# EAGLE design stoveguard (EAGLE 9.6.2)
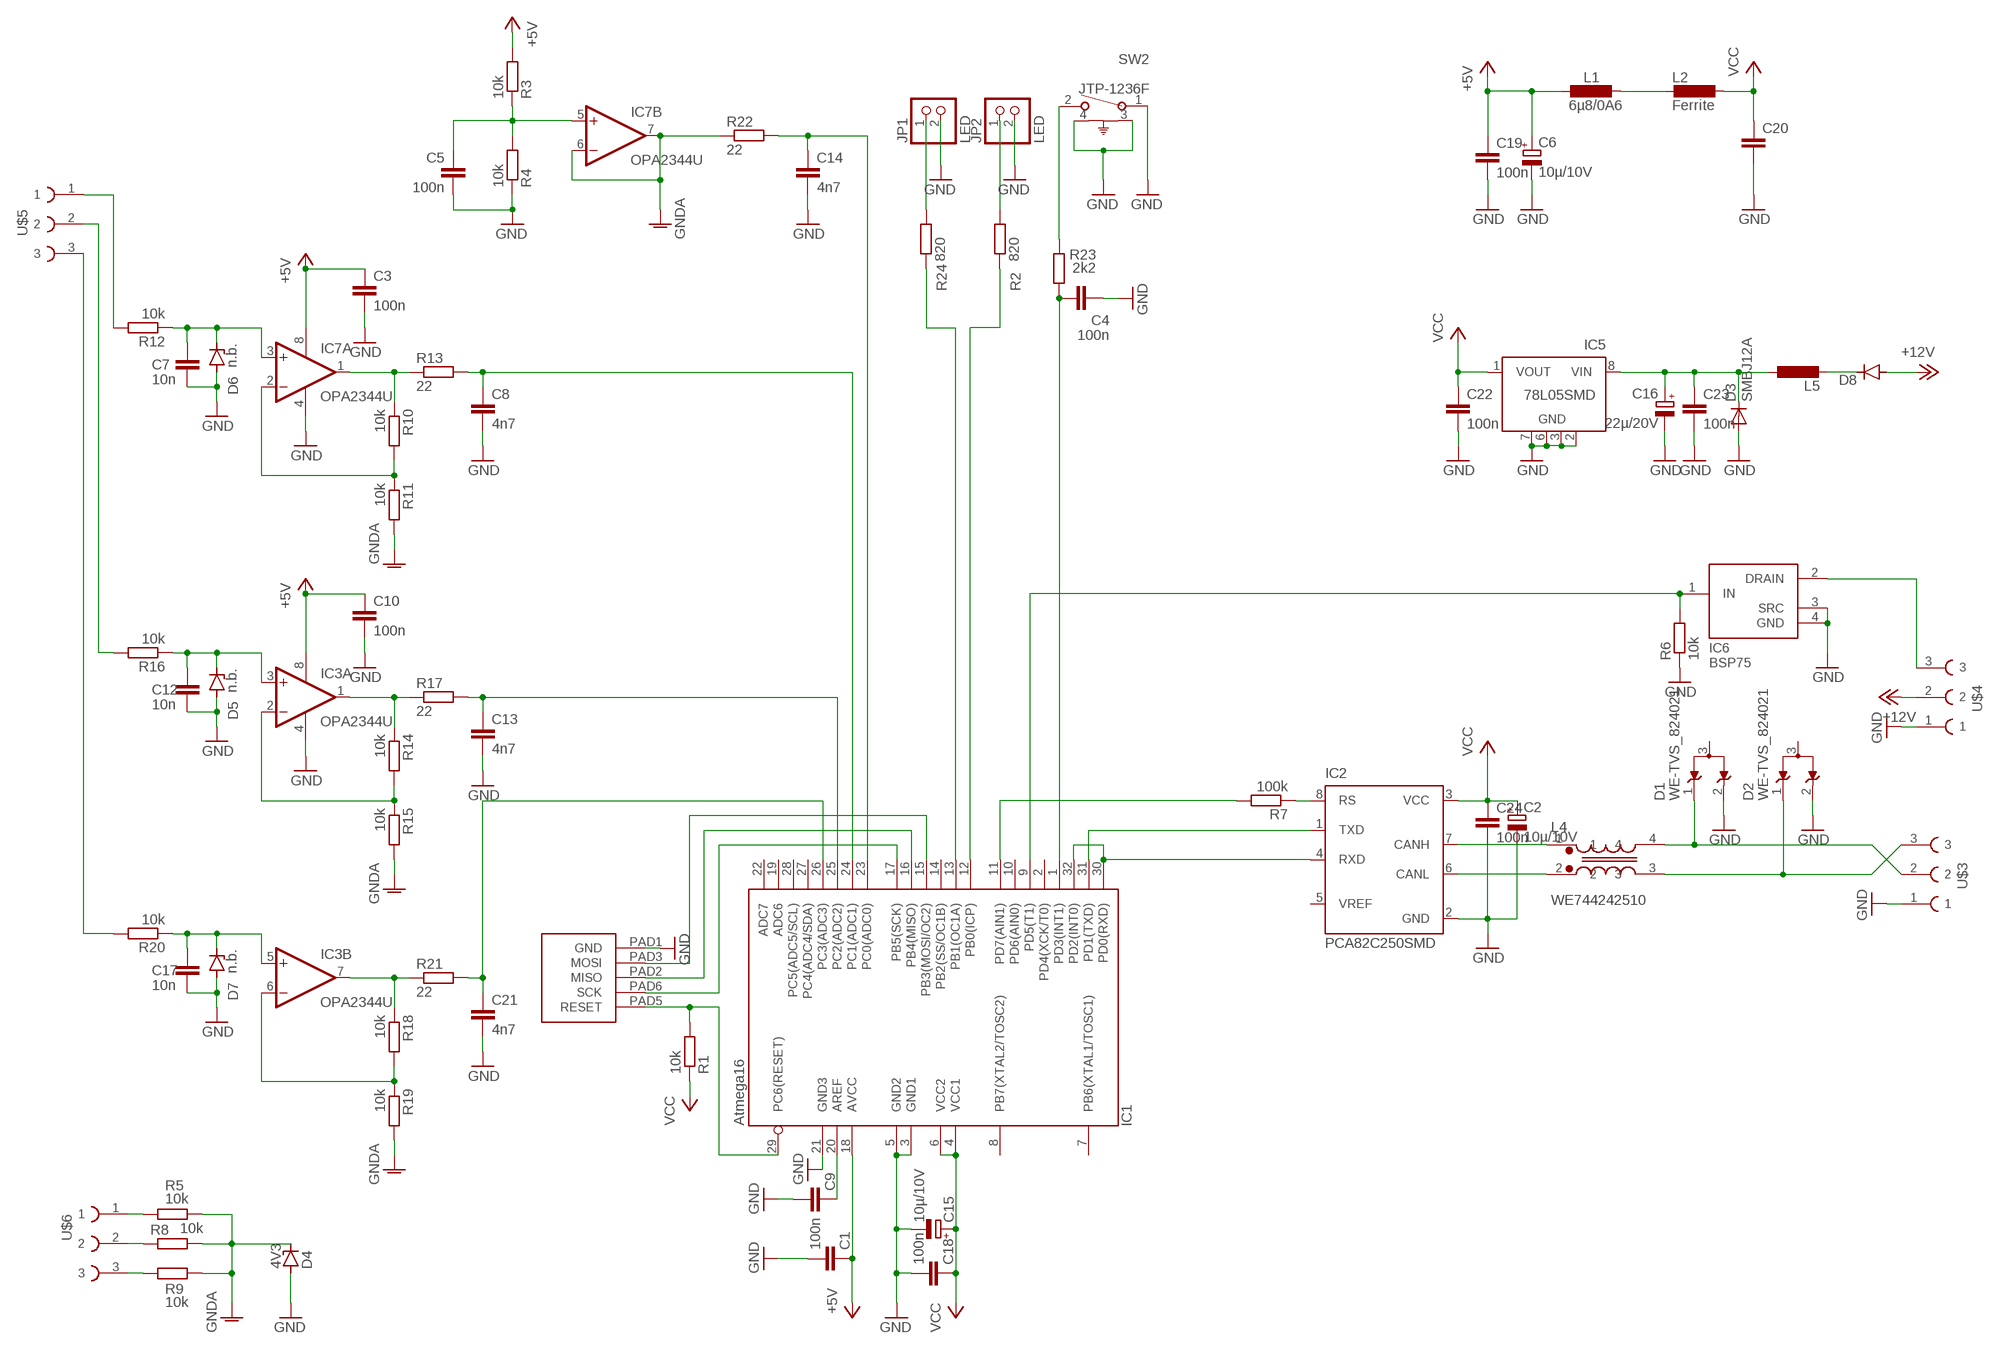
[diagram p0: schematic, sheet 1]

## Parts
C1  100n  CC0603  [C0603]
C2  10µ/10V  CPOL-EUA/3216-18W  [A/3216-18W]
C3  100n  CC0603  [C0603]
C4  100n  CC0603  [C0603]
C5  100n  CC0603  [C0603]
C6  10µ/10V  CPOL-EUA/3216-18W  [A/3216-18W]
C7  10n  CC0603  [C0603]
C8  4n7  CC0603  [C0603]
C9  CC1206  [C1206]
C10  100n  CC0603  [C0603]
C12  10n  CC0603  [C0603]
C13  4n7  CC0603  [C0603]
C14  4n7  CC0603  [C0603]
C15  10µ/10V  CPOL-EUA/3216-18W  [A/3216-18W]
C16  22µ/20V  CPOL-EUSMCC  [SMC_C]
C17  10n  CC0603  [C0603]
C18  100n  CC0603  [C0603]
C19  100n  CC0603  [C0603]
C20  CC0603  [C0603]
C21  4n7  CC0603  [C0603]
C22  100n  CC0603  [C0603]
C23  100n  CC0603  [C0603]
C24  100n  CC0603  [C0603]
D1  WE-TVS_824021  [WE-TVS_SOT23-3L]
D2  WE-TVS_824021  [WE-TVS_SOT23-3L]
D3  SMBJ12A  DIODE-SMB  [SMB]
D4  4V3  ZENER-DIODESOD80C  [SOD80C]
D5  n.b.  ZENER-DIODESOD80C  [SOD80C]
D6  n.b.  ZENER-DIODESOD80C  [SOD80C]
D7  n.b.  ZENER-DIODESOD80C  [SOD80C]
D8  DIODE-MINIMELF  [MINIMELF]
IC1  Atmega16  ATMEGA8  [TQFP32-08]
IC2  PCA82C250SMD  [SO8]
IC3  OPA2344U  [SO08]
IC5  78L05SMD  [SO08]
IC6  BSP75  [SOT223]
IC7  OPA2344U  [SO08]
JP1  LED  PINHD-1X2  [1X02]
JP2  LED  PINHD-1X2  [1X02]
L1  6µ8/0A6  L-EUL1812  [L1812]
L2  Ferrite  L-EUL1806  [L1806]
L4  WE744242510  WE-SLM  [WE-SLM]
L5  L-EUL1806  [L1806]
R1  10k  RR0603  [R0603]
R2  820  RR0603  [R0603]
R3  10k  RR0603  [R0603]
R4  10k  RR0603  [R0603]
R5  10k  RR0603  [R0603]
R6  10k  RR0603  [R0603]
R7  100k  RR0603  [R0603]
R8  10k  RR0603  [R0603]
R9  10k  RR0603  [R0603]
R10  10k  RR0603  [R0603]
R11  10k  RR0603  [R0603]
R12  10k  RR0603  [R0603]
R13  22  RR0603  [R0603]
R14  10k  RR0603  [R0603]
R15  10k  RR0603  [R0603]
R16  10k  RR0603  [R0603]
R17  22  RR0603  [R0603]
R18  10k  RR0603  [R0603]
R19  10k  RR0603  [R0603]
R20  10k  RR0603  [R0603]
R21  22  RR0603  [R0603]
R22  22  RR0603  [R0603]
R23  2k2  RR0603  [R0603]
R24  820  RR0603  [R0603]
SW2  JTP-1236F  1-1825027-4  [SW2_1825027-E]
U$2  ATMEL_ISP  [ATMEL_ISP]
U$3  MKDSO_2.5/3_L  [PHOENIX_MKDSO_2.5/3_L]
U$4  MKDSO_2.5/3_L  [PHOENIX_MKDSO_2.5/3_L]
U$5  MKDSO_2.5/3_R  [PHOENIX_MKDSO_2.5/3_R]
U$6  MKDSO_2.5/3_R  [PHOENIX_MKDSO_2.5/3_R]

## Nets
+5V: C1.1 C3.1 C6.+ C10.1 C19.1 IC1.18(AVCC) IC3.8(A:V+) IC7.8(A:V+) L1.2 R3.2
+12V: D8.A U$4.2
B+: D1.1 L4.4 U$3.2
B-: D2.1 L4.3 U$3.3
GND: C1.2 C2.- C3.2 C4.1 C5.2 C6.- C7.2 C8.2 C9.2 C10.2 C12.2 C13.2 C14.2 C15.- C16.- C17.2 C18.2 C19.2 C20.2 C21.2 C22.2 C23.2 C24.2 D1.2 D2.2 D3.A D4.A D5.A D6.A D7.A IC1.3(GND1) IC1.5(GND2) IC1.21(GND3) IC2.2(GND) IC3.4(A:V-) IC5.2(GND) IC5.3(GND) IC5.6(GND) IC5.7(GND) IC6.3(SRC) IC6.4(GND) IC7.4(A:V-) JP1.2 JP2.2 R4.1 R6.1 SW2.1 SW2.3 SW2.4 U$2.PAD1(GND) U$3.1 U$4.1
GNDA: D4.C IC7.6(B:-IN) IC7.7(B:OUT) R5.1 R8.1 R9.1 R11.2 R15.2 R19.2 R22.1
N$1: L1.1 L2.2
N$2: IC6.2(DRAIN) U$4.3
N$3: C9.1 IC1.20(AREF)
N$4: IC1.15(PB3(MOSI/OC2)) U$2.PAD3(MOSI)
N$5: IC1.16(PB4(MISO)) U$2.PAD2(MISO)
N$6: IC1.17(PB5(SCK)) U$2.PAD6(SCK)
N$7: IC1.9(PD5(T1)) IC6.1(IN) R6.2
N$8: R5.2 U$6.1
N$9: C5.1 IC7.5(B:+IN) R3.1 R4.2
N$10: IC2.7(CANH) L4.1
N$11: R8.2 U$6.2
N$12: R9.2 U$6.3
N$13: JP1.1 R24.2
N$14: IC1.12(PB0(ICP)) R2.1
N$15: IC1.11(PD7(AIN1)) R7.2
N$16: IC1.31(PD1(TXD)) IC2.1(TXD)
N$17: IC2.6(CANL) L4.2
N$18: IC1.30(PD0(RXD)) IC1.32(PD2(INT0)) IC2.4(RXD)
N$19: R12.2 U$5.1
N$20: IC1.29(PC6(RESET)) R1.2 U$2.PAD5(RESET)
N$21: C7.1 D6.C IC7.3(A:+IN) R12.1
N$22: IC7.2(A:-IN) R10.2 R11.1
N$23: IC7.1(A:OUT) R10.1 R13.1
N$24: C4.2 IC1.1(PD3(INT1)) R23.2
N$25: R23.1 SW2.2
N$26: C8.1 IC1.24(PC1(ADC1)) R13.2
N$27: IC2.8(RS) R7.1
N$28: C16.+ C23.1 D3.C IC5.8(VIN) L5.1
N$29: C12.1 D5.C IC3.3(A:+IN) R16.1
N$30: IC3.2(A:-IN) R14.2 R15.1
N$31: IC3.1(A:OUT) R14.1 R17.1
N$32: C13.1 IC1.25(PC2(ADC2)) R17.2
N$33: R16.2 U$5.2
N$34: C17.1 D7.C IC3.5(B:+IN) R20.1
N$35: IC3.6(B:-IN) R18.2 R19.1
N$36: IC3.7(B:OUT) R18.1 R21.1
N$37: C21.1 IC1.26(PC3(ADC3)) R21.2
N$38: R20.2 U$5.3
N$39: C14.1 IC1.23(PC0(ADC0)) R22.2
N$40: D8.C L5.2
N$41: IC1.13(PB1(OC1A)) R24.1
N$42: JP2.1 R2.2
VCC: C2.+ C15.+ C18.1 C20.1 C22.1 C24.1 IC1.4(VCC1) IC1.6(VCC2) IC2.3(VCC) IC5.1(VOUT) L2.1 R1.1
Unconnected: D1.3(GND) D2.3(GND) IC1.2(PD4(XCK/T0)) IC1.7(PB6(XTAL1/TOSC1)) IC1.8(PB7(XTAL2/TOSC2)) IC1.10(PD6(AIN0)) IC1.14(PB2(SS/OC1B)) IC1.19(ADC6) IC1.22(ADC7) IC1.27(PC4(ADC4/SDA)) IC1.28(PC5(ADC5/SCL)) IC2.5(VREF) IC5.4(NC) IC5.5(NC)

## Library data of the parts
C1 C3-C5 C7-C10 C12-C14 C17-C24 = eagle-ltspice:C: CAPACITOR, European symbol; SPICEMODEL: NONE; SPICEPREFIX: C
C2 C6 C15 C16 = rcl:CPOL-EU: POLARIZED CAPACITOR, European symbol
D1 D2 = EagleLibrary_Wuerth_Elektronik_eiSos_V6_20140807:WE-TVS_824021: TVS Diode Array WE-TVS, Standard Series - Low capazity - No leakage current - Low clamping voltage - high ESD voltage protection - Uni- and bidirectional protection -- DC Distribution -- Headsets and Accessoires -- PDAs -- Digital Cameras -- MP3-Players -- Touch Panels <http://katalog.we-online.de/media/images/eisos/VarTVS_highspeed_pf2.jpg.jpg> Details see: http://katalog.we-online.de/en/pbs/WE-TVS_High_Speed? Updated by Dan Xu 2014-07-11 2014 (C) Würth Elektronik
D3 D8 = diode:DIODE-: DIODE
D4-D7 = diode:ZENER-DIODE: Z-Diode
IC1 = mylib:ATMEGA8: 8-bit AVR with 8K Bytes In-System Programmable Flash
IC2 = mylib:PCA82C250: CAN CONTROLLER INTERFACE
IC3 IC7 = linear:OPA2*: Dual Operational Amplifier Low Power, Single-Supply, Rail-To-Rail Operational Amplifier Source: http://focus.ti.com/lit/ds/symlink/opa2345.pdf http://focus.ti.com .. opa241.pdf http://focus.ti.com/lit/ds/symlink/opa2134.pdf
IC5 = linear:78L*SMD: Positive VOLTAGE REGULATOR
IC6 = mylib:BSP75
JP1 JP2 = pinhead:PINHD-1X2: PIN HEADER
L1 = rcl:L-EU: INDUCTOR, European symbol
L2 L5 = mylib:L-EU: INDUCTOR, European symbol
L4 = EagleLibrary_Wuerth_Elektronik_eiSos_V6_20140807:WE-SLM: SMD Common Mode Line Filter WE-SLM - Small size - Low Profile - High Impedance - High current capability up to 300 mA -- USB -- CAN -- Firewire -- Data Lines -- Power supply systems -- Signal Lines <http://katalog.we-online.de/media/images/eisos/IndSLM_pf2.jpg> Details see: http://katalog.we-online.de/en/pbs/WE-SLM?? Updated by Dan Xu 2014-07-11 2014 (C) Würth Elektronik
R1-R24 = eagle-ltspice:R: RESISTOR, European symbol; SPICEMODEL: NONE; SPICEPREFIX: R
SW2 = Switches:1-1825027-4; BUILT_BY: EMA_UL_Team; CATEGORY: Tactile Switches; CONFIGURATION__POLE-THROW_: Single Pole - Single Throw; CONTACT_CURRENT_RATING: 50; COPYRIGHT: Copyright (C) 2016 Accelerated Designs. All rights reserved; DESCRIPTION: FSMRA5JH04=R/A,TACT PB SW,160G; MANUFACTURER_PART_NUMBER: 1-1825027-4; MAX_SWITCHING_CURRENT: -; MAX_SWITCHING_VOLTAGE_AC_: -; PART_STATUS: active; PRODUCT_TYPE: Switch; SERIES: Unknown; SWITCH_TYPE: Tactile Switches; TE_INTERNAL_NUMBER: 1-1825027-4; TE_PART_NUMBER: 1-1825027-4; VENDOR: TE Connectivity; VOLTAGE_RATING: -
U$2 = mylib:ATMEL_ISP
U$3 U$4 = mylib:MKDSO_2.5/3_L
U$5 U$6 = mylib:MKDSO_2.5/3_R

## Board
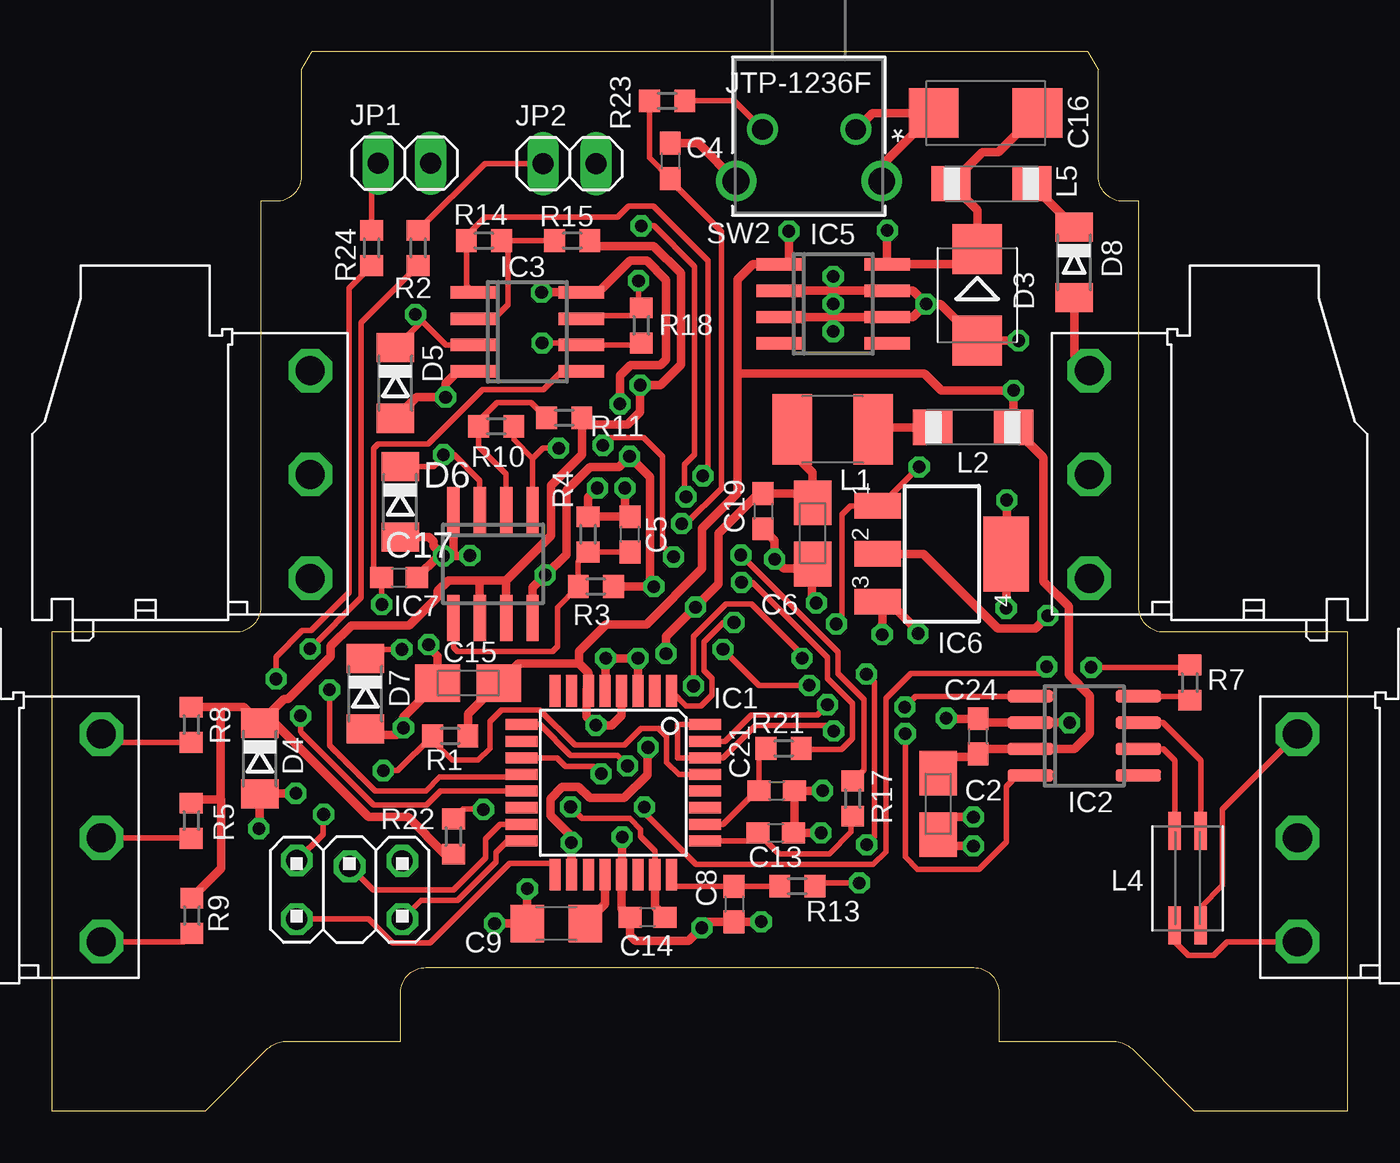
[diagram p1: board, top side]
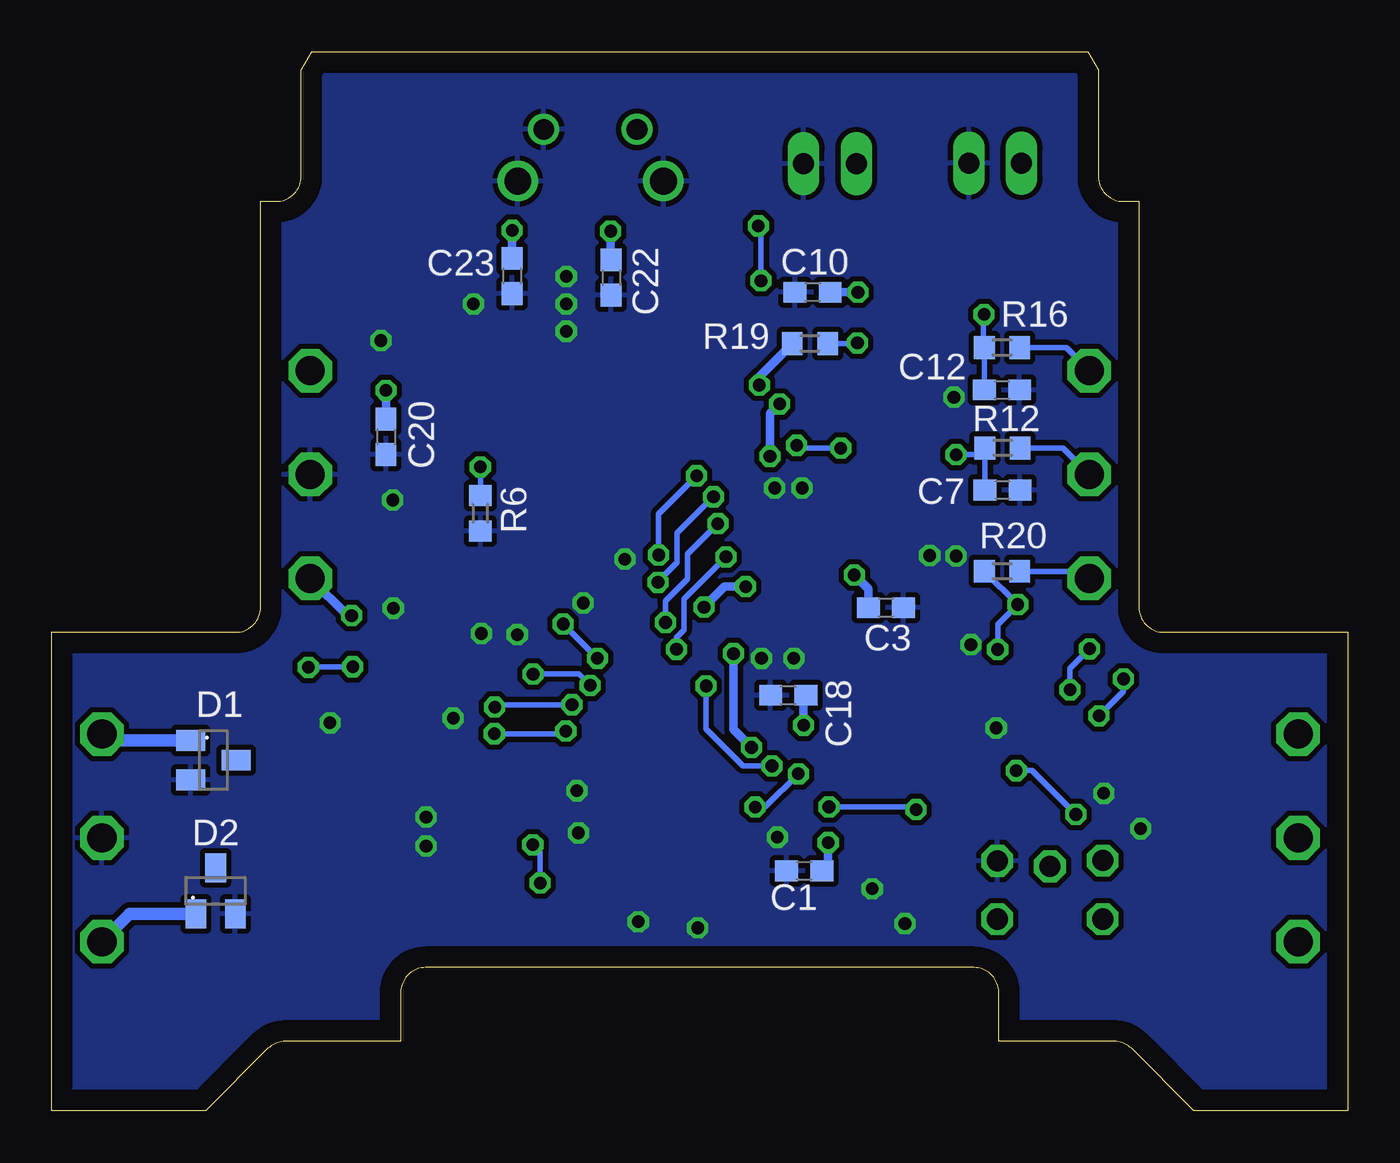
[diagram p2: board, bottom side, seen from below]

Size 62.4 x 51 mm. Coordinates in mm from the lower left corner, seen from the top.
Copper layers (1*16): Top 0.035mm / dielectric 1.5mm / Bottom 0.035mm
Design rules "Bilex DRU *": minimum track width 10mil, minimum drill 24mil, track to track 10mil, track to pad 10mil, pad to pad 10mil, via to via 10mil, smd to smd 10mil, copper to edge 40mil, drill to drill 8mil, minimum pad ring 10mil, minimum via ring 8mil, stop-mask expansion 4mil, vias tented up to drill 0mil, thermal gap 10mil

### Footprints (pad centres in the part's own frame; a part is rotated, then mirrored left to right if it is on the bottom)
C0603 = smd 1.1 x 1: 1 -0.85,0; 2 0.85,0
A/3216-18W = smd 2.15 x 1.8: + 1.475,0; - -1.475,0
C1206 = smd 1.6 x 1.8: 1 -1.4,0; 2 1.4,0
SMC_C = smd 2.4 x 2.4: + -2.5,0; - 2.5,0
WE-TVS_SOT23-3L = smd 1 x 1.4: 1 -0.95,-1.1; 2 0.95,-1.1; 3 0,1.1
SMB = smd 2.4 x 2.4: A 2.2,0; C -2.2,0
SOD80C = smd 1.4 x 1.8: A 1.7,0; C -1.7,0
MINIMELF = smd 1.4 x 1.8: A 1.7,0; C -1.7,0
TQFP32-08 = smd 1.524 x 0.533: 1 -4.42,2.8; 2 -4.42,2; 3 -4.42,1.2; 4 -4.42,0.4; 5 -4.42,-0.4; 6 -4.42,-1.2; 7 -4.42,-2; 8 -4.42,-2.8; 17 4.42,-2.8; 18 4.42,-2; 19 4.42,-1.2; 20 4.42,-0.4; 21 4.42,0.4; 22 4.42,1.2; 23 4.42,2; 24 4.42,2.8 | smd 0.533 x 1.524: 9 -2.8,-4.42; 10 -2,-4.42; 11 -1.2,-4.42; 12 -0.4,-4.42; 13 0.4,-4.42; 14 1.2,-4.42; 15 2,-4.42; 16 2.8,-4.42; 25 2.8,4.42; 26 2,4.42; 27 1.2,4.42; 28 0.4,4.42; 29 -0.4,4.42; 30 -1.2,4.42; 31 -2,4.42; 32 -2.8,4.42
SO8 = smd 0.6 x 2.2: 1 -1.905,-2.6; 2 -0.635,-2.6; 3 0.635,-2.6; 4 1.905,-2.6; 5 1.905,2.6; 6 0.635,2.6; 7 -0.635,2.6; 8 -1.905,2.6
SO08 = smd 0.6 x 2.2: 1 -1.905,-2.6; 2 -0.635,-2.6; 3 0.635,-2.6; 4 1.905,-2.6; 5 1.905,2.6; 6 0.635,2.6; 7 -0.635,2.6; 8 -1.905,2.6
SOT223 = smd 1.219 x 2.235: 1 -2.311,-3.099; 2 0,-3.099; 3 2.311,-3.099 | smd 3.6 x 2.2: 4 0,3.099
1X02 = drill 1.016 long: 1 -1.27,0; 2 1.27,0
L1812 = smd 1.9 x 3.4: 1 -1.95,0; 2 1.95,0
L1806 = smd 1.9 x 1.7: 1 -0.68,0; 2 3.22,0
WE-SLM = smd 1.85 x 0.6: 1 -2.28,0.63; 2 -2.28,-0.62; 3 2.27,-0.62; 4 2.27,0.63
R0603 = smd 1 x 1.1: 1 -0.85,0; 2 0.85,0
SW2_1825027-E = drill 0.991 pad 1.499: 1 0,0; 2 4.496,0 | drill 1.295 pad 1.803: 3 -1.245,2.489; 4 5.766,2.489
ATMEL_ISP = drill 1.016 octagon: PAD1 1.397,-2.54; PAD2 -1.41,-2.54; PAD3 1.13,0; PAD5 1.41,2.54; PAD6 -1.41,2.54
PHOENIX_MKDSO_2.5/3_L = drill 1.4 octagon: 1 -7.1,-0.62; 2 -7.1,4.38; 3 -7.1,-5.62
PHOENIX_MKDSO_2.5/3_R = drill 1.4 octagon: 1 7.1,-0.62; 2 7.1,4.38; 3 7.1,-5.62

### Placement (x,y rotation side)
C1  26.17,11.56 180 bottom
C2  42.68,14.78 90 top
C3  22.23,24.23 0 bottom
C4  29.78,45.75 270 top
C5  27.85,27.76 90 top
C6  36.64,27.81 90 top
C7  16.62,29.9 0 bottom
C8  32.85,9.96 270 top
C9  24.29,9.02 180 top
C10  25.76,39.42 180 bottom
C12  16.65,34.72 0 bottom
C13  34.86,13.39 0 top
C14  28.69,9.32 180 top
C15  20.05,20.6 0 top
C16  44.97,48.06 180 top
C17  16.72,25.68 0 top
C18  26.93,20.02 180 bottom
C19  34.25,28.88 270 top
C20  46.31,32.46 270 bottom
C21  34.91,15.42 0 top
C22  35.47,40.13 270 bottom
C23  40.24,40.21 270 bottom
C24  44.61,18.03 90 top
D1  54.62,16.89 270 bottom
D2  54.52,10.59 0 bottom
D3  44.56,39.29 270 top
D4  10.02,16.97 270 top
D5  16.54,35.05 270 top
D6  16.77,29.34 270 top
D7  15.1,20.09 270 top
D8  49.23,40.87 270 top
IC1  27.03,15.8 270 top
IC2  49.72,18.06 270 top
IC3  22.89,37.52 270 top
IC5  37.63,38.86 270 top
IC6  42.86,26.82 270 top
IC7  21.24,26.34 180 top
JP1  16.98,45.64 0 top
JP2  24.93,45.62 0 top
L1  37.6,32.82 180 top
L2  45.63,32.92 180 top
L4  54.7,11.2 270 top
L5  43.98,44.65 0 top
R1  19.19,18.06 180 top
R2  17.64,41.55 90 top
R3  26.2,25.25 0 top
R4  25.82,27.76 270 top
R5  6.71,13.97 270 top
R6  41.77,28.78 90 bottom
R7  54.8,20.62 90 top
R8  6.71,18.59 270 top
R9  6.74,9.4 270 top
R10  21.4,32.97 180 top
R11  24.67,33.38 0 top
R12  16.62,31.93 0 bottom
R13  35.9,10.82 180 top
R14  20.81,41.91 0 top
R15  25.05,41.91 0 top
R16  16.65,36.75 0 bottom
R17  38.57,15.04 270 top
R18  28.38,37.82 270 top
R19  25.89,36.96 180 bottom
R20  16.65,25.98 0 bottom
R21  35.24,17.45 180 top
R22  19.34,13.21 90 top
R23  29.63,48.64 180 top
R24  15.4,41.55 90 top
SW2  38.72,47.27 180 top
U$2  14.33,10.64 90 top
U$3  67.09,13.77 0 top
U$4  57.06,31.27 0 top
U$5  5.34,31.27 0 top
U$6  -4.72,13.77 0 top
U$7  [GEHÄUSE_PHOENIX_BC_17.8_REDUCED]  31.2,0 0 top

### Tracks (layer width: path | path; a pad name or v marks a point on that pad's centre or on a via)
+5V  (via drill 0.61)
  Top 0.406: L1.2 35.65,31.73 36.64,30.74 C6.+ 36.19,29.73 C19.1 34.04,29.73 32.11,27.8 32.11,25.36 v31,24.26 29.57,22.84 v29.57,22.02 | R3.2 v28.99,25.25 28.81,25.43 28.81,30.53 v27.82,31.52 27.31,31.01 25.92,31.01 24.77,29.86 24.77,26.8 23.78,25.81 v23.76,25.81 23.15,25.2 IC7.8 | v28.71,17.5 28.68,17.48 28.68,16.19 27.56,15.06 25.91,15.06 25.37,15.6 24.57,15.6 24.01,15.03 24.01,14.23 25.01,13.23 v25.01,12.92 25.03,12.9 IC1.18 | v23.58,39.42 IC3.8 26.32,39.42 27.85,40.95 28.65,40.95 29.59,40.01 29.59,36.19 29.31,35.92 27.87,35.92 27.36,35.4 v27.36,34.05
  Bottom 0.406: v31,24.26 30.01,25.25 v28.99,25.25 | v27.36,34.05 27.82,33.58 v27.82,31.52 | C1.1 25.01,11.86 v25.01,12.92 | C3.1 23.08,25.13 v23.76,25.81 | v28.71,17.5 29.57,18.36 v29.57,22.02 | C10.1 v23.58,39.42
+12V
  Top 0.406: U$4.2 49.23,36.37 D8.A
B+
  Top 0.254: L4.4 55.33,9.8 56.37,10.85 56.37,14.53 U$3.2
  Bottom 0.61: D1.1 59.68,17.84 U$3.2
B-
  Top 0.254: L4.3 54.08,8.14 54.72,7.49 55.96,7.49 56.61,8.15 U$3.3
  Bottom 0.61: D2.1 58.64,9.49 U$3.3
GND  (via drill 0.61)
  Top 0.254: 9.99,13.61 v9.97,13.59 | 11.62,15.24 11.69,15.24 v11.74,15.29
  Top 0.406: v18.14,22.45 18.14,22.33 18.57,21.9 C15.- 16.92,18.95 v16.92,18.44 16.59,18.11 15.38,18.11 D7.A | SW2.3 39.96,45.55 C16.- 39.51,48.06 SW2.1 | 37.63,39.5 IC5.7 41.46,39.5 v42.1,38.86 | 37.63,39.5 IC5.2 | IC5.3 IC5.6 41.46,38.23 v42.1,38.86 | v39.99,22.94 39.99,24.28 IC6.3 40.32,24.51 41.77,23.06 41.77,23.04 v41.72,22.99 | v36.81,24.46 36.61,24.66 36.61,26.31 36.64,26.29 C6.- 36.46,26.16 36.46,26.11 35.27,26.11 v34.81,26.57 34.81,27.47 C19.2 | v43.07,18.91 43.09,18.92 43.13,18.88 C24.2 44.8,18.69 IC2.2 v49,18.69 | v18.86,26.72 18.39,27.19 18.39,27.42 18.17,27.64 D6.A | v27.47,13.18 27.47,11.41 IC1.21 27.43,9.72 C14.2 27.83,8.45 28.1,8.18 30.67,8.18 v31.3,8.81 31.59,9.11 C8.2 v34.16,9.11 | v18.86,26.72 19.29,26.72 | 19.29,26.72 20.1,26.72 v20.13,26.75 | IC7.4 19.34,26.77 19.29,26.72 | C17.2 18.61,26.72 v18.86,26.72 | C4.1 31.14,46.59 SW2.4 | v11.74,15.29 10.04,15.29 D4.A 10.02,13.64 9.99,13.61 | IC1.3 v28.23,21.79 v26.67,21.79 26.67,20.25 IC1.5 | v45.98,29.41 45.98,26.85 IC6.4 v45.96,24.21 | v37.12,15.42 C21.2 35.76,13.44 C13.2 v37.04,13.39 | v42.1,38.86 42.79,38.86 D3.A v46.55,37.09 v46.55,37.1 | v37.63,40.18 37.63,39.5 | 37.63,39.5 v37.63,38.86 v37.63,37.54 | v26.27,30 25.82,29.54 R4.1 C5.2 27.59,28.87 v27.59,30 | v21.32,9.02 C9.2 v22.89,10.69 | IC3.4 19.54,35.61 18.96,35.03 v18.96,34.37 17.56,34.37 D5.A | v44.38,12.75 43.24,12.75 C2.- 43.52,14.15 v44.38,14.15
  pour Bottom: 0.01,0 62.39,0 62.39,5.23 62.39,51 36.94,51 0.01,51
GNDA  (via drill 0.61)
  Top 0.254: D4.C 9.86,18.82
  Top 0.406: D4.C | 9.86,18.82 9.24,19.44 8.14,19.44 | 8.14,19.44 R8.1 | R5.1 6.88,14.99 8.16,14.99 | R9.1 8.16,11.67 8.16,14.99 | 8.16,14.99 8.14,15.01 8.14,19.44 | R22.1 18.94,12.36 17.15,14.15 15.26,14.15 10.74,18.67 D4.C | D4.C 11.19,19.84 11.38,19.84 13.43,21.89 13.43,22.38 14.43,23.37 16.74,23.37 17.21,23.37 18.58,24.74 18.58,25.03 19.1,25.55 20.61,25.55 | R15.2 26.16,41.66 28.98,41.66 30.3,40.34 30.3,35.94 29.31,34.95 v28.33,34.95 28.33,33.66 27.73,33.05 25.84,33.05 R11.2 25.52,31.61 24.04,30.13 24.04,27.71 21.88,25.55 | 20.61,25.55 21.88,25.55 | 20.61,25.55 IC7.6 | IC7.7 21.88,25.55
  Bottom 0.406: R19.2 28.33,35.37 v28.33,34.95
N$1
  Top 0.406: L2.2 39.65,32.92 L1.1
N$2  (via drill 0.61)
  Top 0.406: IC6.2 41.98,26.82 45.56,23.24 47.35,23.24 v47.96,23.85
  Bottom 0.406: U$4.3 48.16,23.85 v47.96,23.85
N$3
  Top 0.406: IC1.20 26.63,9.96 C9.1
N$4
  Top 0.254: U$2.PAD3 15.46,10.64 19.34,10.64 20.89,12.19 20.89,13.11 21.58,13.8 IC1.15
N$5
  Top 0.254: U$2.PAD2 17.78,10.13 19.55,10.13 21.4,11.98 21.4,12.45 21.95,13 IC1.16
N$6
  Top 0.254: U$2.PAD6 15.26,9.23 16.4,8.09 18.22,8.09 22.04,11.91 24.21,11.91 24.23,11.89 IC1.17
N$7  (via drill 0.61)
  Top 0.254: v41.77,31.01 39.89,29.13 IC6.1 38.46,29.13 38.06,28.73 38.06,23.72 v37.78,23.44 | v30.89,20.46 30.89,22.85 32.46,24.41 33.7,24.41 36.13,21.98 v36.13,21.79 | IC1.9 23.5,18.6 24.98,17.12 27.25,17.12 27.72,16.65 v27.72,16.61
  Bottom 0.254: v36.13,21.79 v37.78,23.44 | v27.72,16.61 29.12,16.61 30.89,18.39 v30.89,20.46 | v41.77,31.01 R6.2
N$8
  Top 0.254: U$6.1 6.69,13.15 R5.2
N$9
  Top 0.254: C5.1 R4.2 25.35,26.44 R3.1 24.34,24.24 24.34,22.35 24.11,22.12 19.54,22.12 19.34,22.33 IC7.5
N$10
  Top 0.254: IC2.7 53.5,18.69 55.33,16.87 L4.1
N$11
  Top 0.254: U$6.2 2.79,17.74 R8.2
N$12
  Top 0.254: U$6.3 6.34,8.15 R9.2
N$13
  Top 0.254: R24.2 15.4,45.34 JP1.1
N$14  (via drill 0.61)
  Top 0.254: v13.37,20.28 13.37,17.6 15.55,15.42 18.01,15.42 18.67,16.08 22.5,16.08 IC1.12 | R2.1 14.89,37.96 14.89,24.71 v12.43,22.25
  Bottom 0.254: v12.43,22.25 13.37,21.31 v13.37,20.28
N$15  (via drill 0.61)
  Top 0.254: IC1.11 | IC1.11 24.32,17 24.73,16.59 26.09,16.59 v26.45,16.23 | v47.91,21.39 47.58,21.06 41.36,21.06 40.16,19.85 40.16,12.47 39.55,11.86 31.02,11.86 28.53,14.35 v28.53,14.63 | R7.2 54.68,21.36 v50.05,21.36
  Bottom 0.254: v47.91,21.39 50.02,21.39 v50.05,21.36 | v28.53,14.63 28.05,14.63 v26.45,16.23
N$16  (via drill 0.61)
  Top 0.254: v37.35,19.56 36.86,19.07 33.68,19.07 32.41,17.8 IC1.31 | IC2.1 41.6,19.96 v41.08,19.44
  Bottom 0.254: v37.35,19.56 40.96,19.56 v41.08,19.44
N$17
  Top 0.254: IC2.6 53.53,17.42 54.08,16.88 L4.2
N$18  (via drill 0.61)
  Top 0.254: IC1.32 30.13,18.6 30.13,17 IC1.30 32.32,17 33.89,18.57 37.37,18.57 v37.65,18.29 | IC2.4 46.49,16.15 45.96,15.62 45.96,12.95 44.64,11.63 41.69,11.63 41.09,12.23 v41.09,18.16
  Bottom 0.254: v37.65,18.29 37.78,18.16 v41.09,18.16
N$19
  Bottom 0.254: U$5.1 13.72,31.93 R12.2
N$20  (via drill 0.61)
  Top 0.254: U$2.PAD5 13.06,13.32 13.06,14.28 v13.09,14.28 | IC1.29 30.19,16.2 29.6,16.79 29.6,18.02 29.21,18.41 28.37,18.41 27.58,17.63 25.19,17.63 23.5,19.32 21.66,19.32 21.09,18.75 21.09,17.45 20.53,16.89 19.26,16.89 18.34,17.82 R1.2 16.66,16.38 v15.96,16.38
  Bottom 0.254: v13.09,14.28 15.2,16.38 v15.96,16.38
N$21  (via drill 0.61)
  Top 0.254: IC7.3 20.61,30.35 19.36,31.6 v18.86,31.6 18.86,31.52 18.37,31.04 D6.C
  Bottom 0.254: C7.1 R12.1 17.8,31.6 v18.86,31.6
N$22
  Top 0.254: IC7.2 21.88,30.66 20.55,31.99 R10.2 20.55,33.21 21.45,34.11 23.09,34.11 R11.1
N$23  (via drill 0.61)
  Top 0.254: R10.1 22.25,32.32 23.15,31.42 | v38.88,10.97 36.9,10.97 R13.1 | v26.54,32.05 26.92,32.44 28.48,32.44 29.4,31.52 29.4,27.22 v29.94,26.68 | v32.32,22.23 34.05,20.49 v36.48,20.49 | v39.23,21.03 39.61,20.65 39.61,13.18 v39.24,12.81 | v24.41,31.91 23.64,31.91 23.15,31.42 | IC7.1 23.15,31.42
  Bottom 0.254: v39.24,12.81 38.88,12.46 v38.88,10.97 | v36.48,20.49 37.02,21.03 v39.23,21.03 | v24.41,31.91 v24.41,31.92 26.41,31.92 v26.54,32.05 | v32.32,22.23 32.32,22.8 31.96,23.15 31.96,24.65 v29.94,26.68
N$24  (via drill 0.61)
  Top 0.254: v32.85,23.52 32.34,23.52 31.4,22.58 31.4,21.21 31.78,20.83 31.78,20.04 31.25,19.51 30.55,19.51 IC1.1 | R23.2 28.77,45.9 C4.2 29.78,44.81 32.24,42.35 32.24,29.97 30.55,28.28 v30.33,28.28
  Bottom 0.254: v30.33,28.28 31.78,26.82 31.78,25.62 32.85,24.55 v32.85,23.52
N$25
  Top 0.254: R23.1 32.85,48.64 SW2.2
N$26
  Top 0.254: IC1.24 29.83,10.87 29.89,10.81 C8.1 35.03,10.81 R13.2
N$27
  Top 0.254: R7.1 54.61,19.96 IC2.8
N$28  (via drill 0.61)
  Top 0.406: v40.23,42.41 40.19,42.37 40.23,42.33 IC5.8 43.83,40.77 D3.C 44.56,43.39 L5.1 44.82,46.18 45.59,46.18 C16.+
  Bottom 0.406: v40.23,42.41 40.24,42.39 C23.1
N$29  (via drill 0.61)
  Top 0.254: v17.51,38.35 17.83,38.04 | 17.83,38.04 18.98,36.88 IC3.3 | D5.C 17.83,38.03 17.83,38.04
  Bottom 0.254: C12.1 R16.1 17.53,36.79 17.53,38.35 v17.51,38.35
N$30
  Top 0.254: R14.2 21.98,41.91 | 21.98,41.91 R15.1 | IC3.2 21.29,38.15 21.98,38.84 21.98,41.91
N$31  (via drill 0.61)
  Top 0.254: IC3.1 19.96,39.75 R14.1 19.96,42.15 20.86,43.05 27.25,43.05 27.76,43.56 28.98,43.56 31.59,40.95 31.59,30.82 v31.35,30.58 | R17.1 39.1,16.42 39.1,19.82 37.86,21.07 37.86,22.1 v33.18,26.77
  Bottom 0.254: v31.35,30.58 33.18,28.75 v33.18,26.77
N$32
  Top 0.254: R17.2 38.49,14.11 38.49,13.42 37.44,12.37 35.02,12.37 C13.1 33.62,13 IC1.25
N$33
  Bottom 0.254: U$5.2 13.55,36.75 R16.2
N$34  (via drill 0.61)
  Top 0.254: D7.C 15.42,21.79 15.85,22.22 v16.85,22.22 | v15.88,24.39 15.88,25.67 C17.1 15.68,25.68 15.49,25.87 15.49,31.89 15.71,32.12 18.11,32.12 20.73,34.75 23.68,34.75 24.54,35.61 IC3.5
  Bottom 0.254: v16.85,22.22 16.85,23.42 v15.88,24.39 17.48,25.98 R20.1
N$35  (via drill 0.61)
  Top 0.254: R18.2 28.29,36.88 IC3.6 25.39,36.98 v23.61,36.98
  Bottom 0.254: R19.1 23.63,36.96 v23.61,36.98
N$36  (via drill 0.61)
  Top 0.254: IC3.7 25.65,38.3 28.01,38.3 R18.1 28.25,38.8 v28.25,39.98 | v30.54,29.57 30.46,29.57 30.46,31.11 30.96,31.61 30.96,40.66 28.99,42.62 v28.38,42.62 | v33.21,25.45 33.74,25.45 37.35,21.84 37.35,20.83 38.55,19.62 38.55,17.93 38.02,17.4 36.14,17.4 R21.1
  Bottom 0.254: v28.38,42.62 28.25,42.49 v28.25,39.98 | v30.54,29.57 32.29,27.82 32.29,26.4 33.21,25.49 v33.21,25.45
N$37
  Top 0.254: IC1.26 32.31,13.8 33.93,15.42 C21.1 34.06,17.12 R21.2
N$38
  Bottom 0.254: U$5.3 12.78,25.98 R20.2
N$39  (via drill 0.61)
  Top 0.254: R22.2 19.81,14.53 20.76,14.53 v20.78,14.51 | v24.97,14.63 25.54,14.07 27.83,14.07 28.36,13.55 28.36,13.21 29.03,12.53 IC1.23
  Top 0.406: IC1.23 29.03,9.82 C14.1
  Bottom 0.254: v20.78,14.51 20.9,14.63 v24.97,14.63
N$40
  Top 0.406: L5.2 47.2,44.61 D8.C
N$41  (via drill 0.61)
  Top 0.254: IC1.13 18.71,15.4 18.04,14.73 15.5,14.73 12.03,18.2 11.97,18.26 v11.97,19.02 | v10.79,20.8 10.79,21.87 12.06,23.14 12.48,23.14 14.31,24.97 14.31,39.61 R24.1
  Bottom 0.254: v10.79,20.8 10.79,20.2 v11.97,19.02
N$42
  Top 0.254: R2.2 20.85,45.62 JP2.1
VCC  (via drill 0.61)
  Top 0.406: 33.03,35.51 33.03,29.75 31.32,28.04 31.32,26.11 28.63,23.42 26.68,23.42 25.39,22.13 25.39,21.54 | 33.03,35.51 42.02,35.51 42.83,34.7 v46.31,34.7 L2.1 47.76,31.46 47.76,25.5 48.98,24.28 48.98,21.01 50,19.99 50,18.19 49.23,17.42 IC2.3 44.85,17.42 C24.1 44.47,17.04 42.96,17.04 42.68,16.76 C2.+ | 25.39,21.54 25.83,21.09 IC1.6 25.76,20.29 25.76,19 v26.2,18.57 26.96,18.57 27.43,19.04 IC1.4 | v35.49,42.37 35.49,40.77 IC5.1 33.77,40.77 33.03,40.03 33.03,35.51 | R1.1 20.04,19.11 C15.+ 22.46,21.54 25.39,21.54
  Bottom 0.406: C22.1 35.49,41.01 v35.49,42.37 | v46.31,34.7 C20.1 | C18.1 26.2,19.9 v26.2,18.57